# Altium schematic sheet 03_8MPLUS_PWR.SchDoc: 8MPLUS_PWR
size 420 x 297 mm; Author: Lukas Henkel; DocumentNumber: 3; SheetNumber: 3; SheetTotal: 16; DocSize: A3
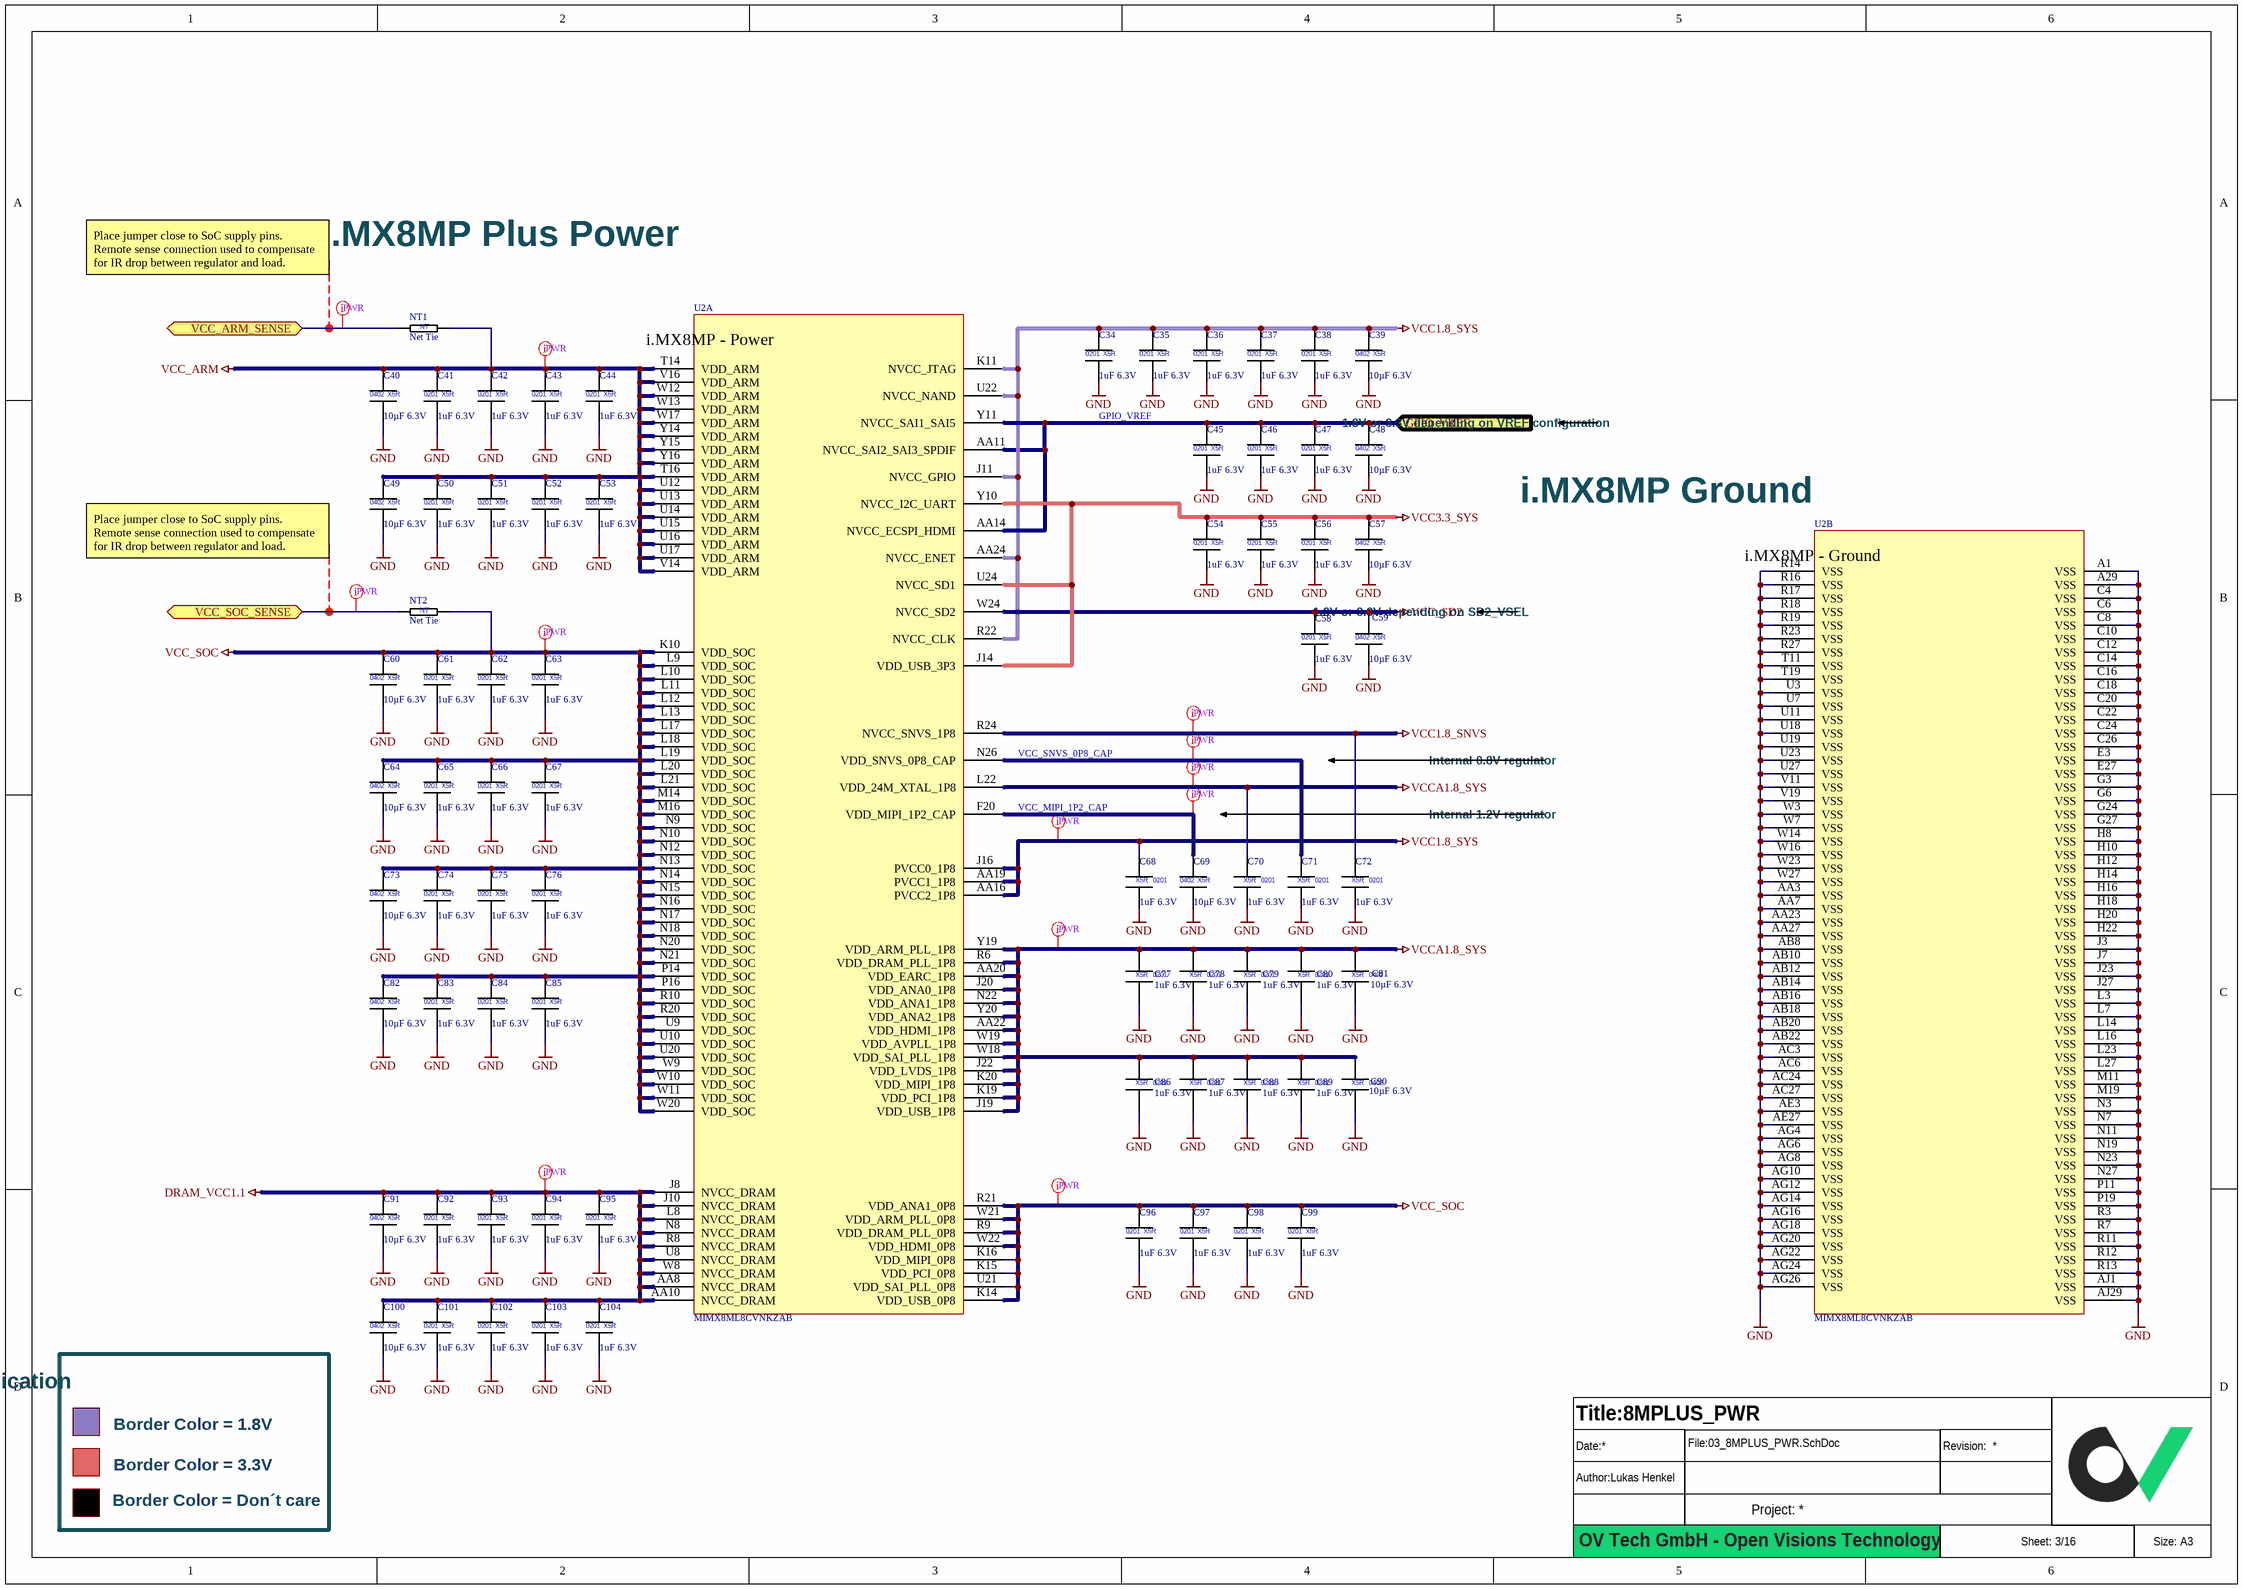
[diagram p0: 03_8MPLUS_PWR.SchDoc]

## Parts
?  (no value)  (graphical)
C34  1uF 6.3V  [CAPC0603X03L]
C35  1uF 6.3V  [CAPC0603X03L]
C36  1uF 6.3V  [CAPC0603X03L]
C37  1uF 6.3V  [CAPC0603X03L]
C38  1uF 6.3V  [CAPC0603X03L]
C39  10µF 6.3V  [CAPC1005X06L]
C40  10µF 6.3V  [CAPC1005X06L]
C41  1uF 6.3V  [CAPC0603X03L]
C42  1uF 6.3V  [CAPC0603X03L]
C43  1uF 6.3V  [CAPC0603X03L]
C44  1uF 6.3V  [CAPC0603X03L]
C45  1uF 6.3V  [CAPC0603X03L]
C46  1uF 6.3V  [CAPC0603X03L]
C47  1uF 6.3V  [CAPC0603X03L]
C48  10µF 6.3V  [CAPC1005X06L]
C49  10µF 6.3V  [CAPC1005X06L]
C50  1uF 6.3V  [CAPC0603X03L]
C51  1uF 6.3V  [CAPC0603X03L]
C52  1uF 6.3V  [CAPC0603X03L]
C53  1uF 6.3V  [CAPC0603X03L]
C54  1uF 6.3V  [CAPC0603X03L]
C55  1uF 6.3V  [CAPC0603X03L]
C56  1uF 6.3V  [CAPC0603X03L]
C57  10µF 6.3V  [CAPC1005X06L]
C58  1uF 6.3V  [CAPC0603X03L]
C59  10µF 6.3V  [CAPC1005X06L]
C60  10µF 6.3V  [CAPC1005X06L]
C61  1uF 6.3V  [CAPC0603X03L]
C62  1uF 6.3V  [CAPC0603X03L]
C63  1uF 6.3V  [CAPC0603X03L]
C64  10µF 6.3V  [CAPC1005X06L]
C65  1uF 6.3V  [CAPC0603X03L]
C66  1uF 6.3V  [CAPC0603X03L]
C67  1uF 6.3V  [CAPC0603X03L]
C68  1uF 6.3V  [CAPC0603X03L]
C69  10µF 6.3V  [CAPC1005X06L]
C70  1uF 6.3V  [CAPC0603X03L]
C71  1uF 6.3V  [CAPC0603X03L]
C72  1uF 6.3V  [CAPC0603X03L]
C73  10µF 6.3V  [CAPC1005X06L]
C74  1uF 6.3V  [CAPC0603X03L]
C75  1uF 6.3V  [CAPC0603X03L]
C76  1uF 6.3V  [CAPC0603X03L]
C77  1uF 6.3V  [CAPC0603X03L]
C78  1uF 6.3V  [CAPC0603X03L]
C79  1uF 6.3V  [CAPC0603X03L]
C80  1uF 6.3V  [CAPC0603X03L]
C81  10µF 6.3V  [CAPC1005X06L]
C82  10µF 6.3V  [CAPC1005X06L]
C83  1uF 6.3V  [CAPC0603X03L]
C84  1uF 6.3V  [CAPC0603X03L]
C85  1uF 6.3V  [CAPC0603X03L]
C86  1uF 6.3V  [CAPC0603X03L]
C87  1uF 6.3V  [CAPC0603X03L]
C88  1uF 6.3V  [CAPC0603X03L]
C89  1uF 6.3V  [CAPC0603X03L]
C90  10µF 6.3V  [CAPC1005X06L]
C91  10µF 6.3V  [CAPC1005X06L]
C92  1uF 6.3V  [CAPC0603X03L]
C93  1uF 6.3V  [CAPC0603X03L]
C94  1uF 6.3V  [CAPC0603X03L]
C95  1uF 6.3V  [CAPC0603X03L]
C96  1uF 6.3V  [CAPC0603X03L]
C97  1uF 6.3V  [CAPC0603X03L]
C98  1uF 6.3V  [CAPC0603X03L]
C99  1uF 6.3V  [CAPC0603X03L]
C100  10µF 6.3V  [CAPC1005X06L]
C101  1uF 6.3V  [CAPC0603X03L]
C102  1uF 6.3V  [CAPC0603X03L]
C103  1uF 6.3V  [CAPC0603X03L]
C104  1uF 6.3V  [CAPC0603X03L]
NT1  Net Tie  [Net_Tie_0.2mm]  (net tie, no BOM)
NT2  Net Tie  [Net_Tie_0.2mm]  (net tie, no BOM)
U2  MIMX8ML8CVNKZAB  [BGA548C50P29X29_1500X1500X148]  (parts A,B of 15)

## Ports
GPIO_VREF (in), VCC_ARM_SENSE (bidir), VCC_SOC_SENSE (bidir)

## Nets
DRAM_VCC1.1: C91.1 C92.1 C93.1 C94.1 C95.1 C100.1 C101.1 C102.1 C103.1 C104.1 U2.AA8(NVCC_DRAM) U2.AA10(NVCC_DRAM) U2.J8(NVCC_DRAM) U2.J10(NVCC_DRAM) U2.L8(NVCC_DRAM) U2.N8(NVCC_DRAM) U2.R8(NVCC_DRAM) U2.U8(NVCC_DRAM) U2.W8(NVCC_DRAM)
GND: C34.2 C35.2 C36.2 C37.2 C38.2 C39.2 C40.2 C41.2 C42.2 C43.2 C44.2 C45.2 C46.2 C47.2 C48.2 C49.2 C50.2 C51.2 C52.2 C53.2 C54.2 C55.2 C56.2 C57.2 C58.2 C59.2 C60.2 C61.2 C62.2 C63.2 C64.2 C65.2 C66.2 C67.2 C68.2 C69.2 C70.2 C71.2 C72.2 C73.2 C74.2 C75.2 C76.2 C77.2 C78.2 C79.2 C80.2 C81.2 C82.2 C83.2 C84.2 C85.2 C86.2 C87.2 C88.2 C89.2 C90.2 C91.2 C92.2 C93.2 C94.2 C95.2 C96.2 C97.2 C98.2 C99.2 C100.2 C101.2 C102.2 C103.2 C104.2 U2.A1(VSS) U2.A29(VSS) U2.AA3(VSS) U2.AA7(VSS) U2.AA23(VSS) U2.AA27(VSS) U2.AB8(VSS) U2.AB10(VSS) U2.AB12(VSS) U2.AB14(VSS) U2.AB16(VSS) U2.AB18(VSS) U2.AB20(VSS) U2.AB22(VSS) U2.AC3(VSS) U2.AC6(VSS) U2.AC24(VSS) U2.AC27(VSS) U2.AE3(VSS) U2.AE27(VSS) U2.AG4(VSS) U2.AG6(VSS) U2.AG8(VSS) U2.AG10(VSS) U2.AG12(VSS) U2.AG14(VSS) U2.AG16(VSS) U2.AG18(VSS) U2.AG20(VSS) U2.AG22(VSS) U2.AG24(VSS) U2.AG26(VSS) U2.AJ1(VSS) U2.AJ29(VSS) U2.C4(VSS) U2.C6(VSS) U2.C8(VSS) U2.C10(VSS) U2.C12(VSS) U2.C14(VSS) U2.C16(VSS) U2.C18(VSS) U2.C20(VSS) U2.C22(VSS) U2.C24(VSS) U2.C26(VSS) U2.E3(VSS) U2.E27(VSS) U2.G3(VSS) U2.G6(VSS) U2.G24(VSS) U2.G27(VSS) U2.H8(VSS) U2.H10(VSS) U2.H12(VSS) U2.H14(VSS) U2.H16(VSS) U2.H18(VSS) U2.H20(VSS) U2.H22(VSS) U2.J3(VSS) U2.J7(VSS) U2.J23(VSS) U2.J27(VSS) U2.L3(VSS) U2.L7(VSS) U2.L14(VSS) U2.L16(VSS) U2.L23(VSS) U2.L27(VSS) U2.M11(VSS) U2.M19(VSS) U2.N3(VSS) U2.N7(VSS) U2.N11(VSS) U2.N19(VSS) U2.N23(VSS) U2.N27(VSS) U2.P11(VSS) U2.P19(VSS) U2.R3(VSS) U2.R7(VSS) U2.R11(VSS) U2.R12(VSS) U2.R13(VSS) U2.R14(VSS) U2.R16(VSS) U2.R17(VSS) U2.R18(VSS) U2.R19(VSS) U2.R23(VSS) U2.R27(VSS) U2.T11(VSS) U2.T19(VSS) U2.U3(VSS) U2.U7(VSS) U2.U11(VSS) U2.U18(VSS) U2.U19(VSS) U2.U23(VSS) U2.U27(VSS) U2.V11(VSS) U2.V19(VSS) U2.W3(VSS) U2.W7(VSS) U2.W14(VSS) U2.W16(VSS) U2.W23(VSS) U2.W27(VSS)
VCC1.8_SNVS: C72.1 U2.R24(NVCC_SNVS_1P8)
VCC1.8_SYS: C34.1 C35.1 C36.1 C37.1 C38.1 C39.1 C68.1 U2.AA16(PVCC2_1P8) U2.AA19(PVCC1_1P8) U2.AA24(NVCC_ENET) U2.J11(NVCC_GPIO) U2.J16(PVCC0_1P8) U2.K11(NVCC_JTAG) U2.R22(NVCC_CLK) U2.U22(NVCC_NAND)
VCC3.3_SYS: C54.1 C55.1 C56.1 C57.1 U2.J14(VDD_USB_3P3) U2.U24(NVCC_SD1) U2.Y10(NVCC_I2C_UART)
VCC_ARM: C40.1 C41.1 C42.1 C43.1 C44.1 C49.1 C50.1 C51.1 C52.1 C53.1 NT1.2 U2.T14(VDD_ARM) U2.T16(VDD_ARM) U2.U12(VDD_ARM) U2.U13(VDD_ARM) U2.U14(VDD_ARM) U2.U15(VDD_ARM) U2.U16(VDD_ARM) U2.U17(VDD_ARM) U2.V14(VDD_ARM) U2.V16(VDD_ARM) U2.W12(VDD_ARM) U2.W13(VDD_ARM) U2.W17(VDD_ARM) U2.Y14(VDD_ARM) U2.Y15(VDD_ARM) U2.Y16(VDD_ARM)
VCC_SD2: C58.1 C59.1 U2.W24(NVCC_SD2)
VCC_SOC: C60.1 C61.1 C62.1 C63.1 C64.1 C65.1 C66.1 C67.1 C73.1 C74.1 C75.1 C76.1 C82.1 C83.1 C84.1 C85.1 C96.1 C97.1 C98.1 C99.1 NT2.2 U2.K10(VDD_SOC) U2.K14(VDD_USB_0P8) U2.K15(VDD_PCI_0P8) U2.K16(VDD_MIPI_0P8) U2.L9(VDD_SOC) U2.L10(VDD_SOC) U2.L11(VDD_SOC) U2.L12(VDD_SOC) U2.L13(VDD_SOC) U2.L17(VDD_SOC) U2.L18(VDD_SOC) U2.L19(VDD_SOC) U2.L20(VDD_SOC) U2.L21(VDD_SOC) U2.M14(VDD_SOC) U2.M16(VDD_SOC) U2.N9(VDD_SOC) U2.N10(VDD_SOC) U2.N12(VDD_SOC) U2.N13(VDD_SOC) U2.N14(VDD_SOC) U2.N15(VDD_SOC) U2.N16(VDD_SOC) U2.N17(VDD_SOC) U2.N18(VDD_SOC) U2.N20(VDD_SOC) U2.N21(VDD_SOC) U2.P14(VDD_SOC) U2.P16(VDD_SOC) U2.R9(VDD_DRAM_PLL_0P8) U2.R10(VDD_SOC) U2.R20(VDD_SOC) U2.R21(VDD_ANA1_0P8) U2.U9(VDD_SOC) U2.U10(VDD_SOC) U2.U20(VDD_SOC) U2.U21(VDD_SAI_PLL_0P8) U2.W9(VDD_SOC) U2.W10(VDD_SOC) U2.W11(VDD_SOC) U2.W20(VDD_SOC) U2.W21(VDD_ARM_PLL_0P8) U2.W22(VDD_HDMI_0P8)
VCCA1.8_SYS: C70.1 C77.1 C78.1 C79.1 C80.1 C81.1 C86.1 C87.1 C88.1 C89.1 C90.1 U2.AA20(VDD_EARC_1P8) U2.AA22(VDD_HDMI_1P8) U2.J19(VDD_USB_1P8) U2.J20(VDD_ANA0_1P8) U2.J22(VDD_LVDS_1P8) U2.K19(VDD_PCI_1P8) U2.K20(VDD_MIPI_1P8) U2.L22(VDD_24M_XTAL_1P8) U2.N22(VDD_ANA1_1P8) U2.R6(VDD_DRAM_PLL_1P8) U2.W18(VDD_SAI_PLL_1P8) U2.W19(VDD_AVPLL_1P8) U2.Y19(VDD_ARM_PLL_1P8) U2.Y20(VDD_ANA2_1P8)
GPIO_VREF: C45.1 C46.1 C47.1 C48.1 U2.AA11(NVCC_SAI2_SAI3_SPDIF) U2.AA14(NVCC_ECSPI_HDMI) U2.Y11(NVCC_SAI1_SAI5) ; port GPIO_VREF
VCC_ARM_SENSE: NT1.1 ; port VCC_ARM_SENSE
VCC_MIPI_1P2_CAP: C69.1 U2.F20(VDD_MIPI_1P2_CAP)
VCC_SNVS_0P8_CAP: C71.1 U2.N26(VDD_SNVS_0P8_CAP)
VCC_SOC_SENSE: NT2.1 ; port VCC_SOC_SENSE

## Layout directives
net class PWR: DRAM_VCC1.1, VCC1.8_SNVS, VCC1.8_SYS, VCC_ARM, VCC_ARM_SENSE, VCC_MIPI_1P2_CAP, VCC_SNVS_0P8_CAP, VCC_SOC, VCC_SOC_SENSE, VCCA1.8_SYS

## Notes on the sheet
- i.MX8MP Plus Power
- Place jumper close to SoC supply pins.
  Remote sense connection used to compensate
  for IR drop between regulator and load.
- 1.8V or 3.3V depending on VREF configuration
- i.MX8MP Ground
- 1.8V or 3.3V depending on SD2_VSEL
- Internal 0.8V regulator
- Internal 1.2V regulator
- Signal Level Indication
- Border Color = 1.8V
- Border Color = 3.3V
- Border Color = Don´t care
- OV Tech GmbH - Open Visions Technology
- (in symbol CAP_0201_1uF_6.3V) 0201; X5R
- (in symbol CAP_0402_10µ_6.3V) 0402; X5R
- (in symbol NetTie_0.2mm) NT
- (in symbol SoC_i.MX 8M Plus_Quad, part A) i.MX8MP - Power
- (in symbol SoC_i.MX 8M Plus_Quad, part B) i.MX8MP - Ground

## Library data of the parts
? = Titleblock_01_OpenSource
C34-C38 C41-C47 C50-C56 C58 C61-C63 C65-C68 C70-C72 C74-C80 C83-C89 C92-C99 C101-C104 = CAP_0201_1uF_6.3V: Multilayer Ceramic Capacitors MLCC - SMD/SMT 0201 6.3VDC; Manufacturer 1: Murata Electronics; Manufacturer 1 Prt. Nr.: GRM033R60J105MEA2D; Manufacturer 2 Prt. Nr.: CL03A105MQ3CSNC; Manufacturer 2: Samsung Electro-Mechanics
C39 C40 C48 C49 C57 C59 C60 C64 C69 C73 C81 C82 C90 C91 C100 = CAP_0402_10µ_6.3V: Multilayer Ceramic Capacitors MLCC - SMD/SMT 0402 6.3VDC; Manufacturer 1: KYOCERA AVX; Manufacturer 1 Prt. Nr.: KGM05CS60J106MH; Manufacturer 2 Prt. Nr.: GRT155C80J106ME13J; Manufacturer 2: Murata
NT1 NT2 = NetTie_0.2mm: Net Tie Element
U2 = SoC_i.MX 8M Plus_Quad: i.MX 8M Plus Applications Processor  for Industrial Products; Manufacturer 1: NXP Semiconductor; Manufacturer 1 Prt. Nr.: MIMX8ML8CVNKZAB